# EAGLE design OPEN DROP DIGISCOPE BOARD 1 (EAGLE 9.3.0)
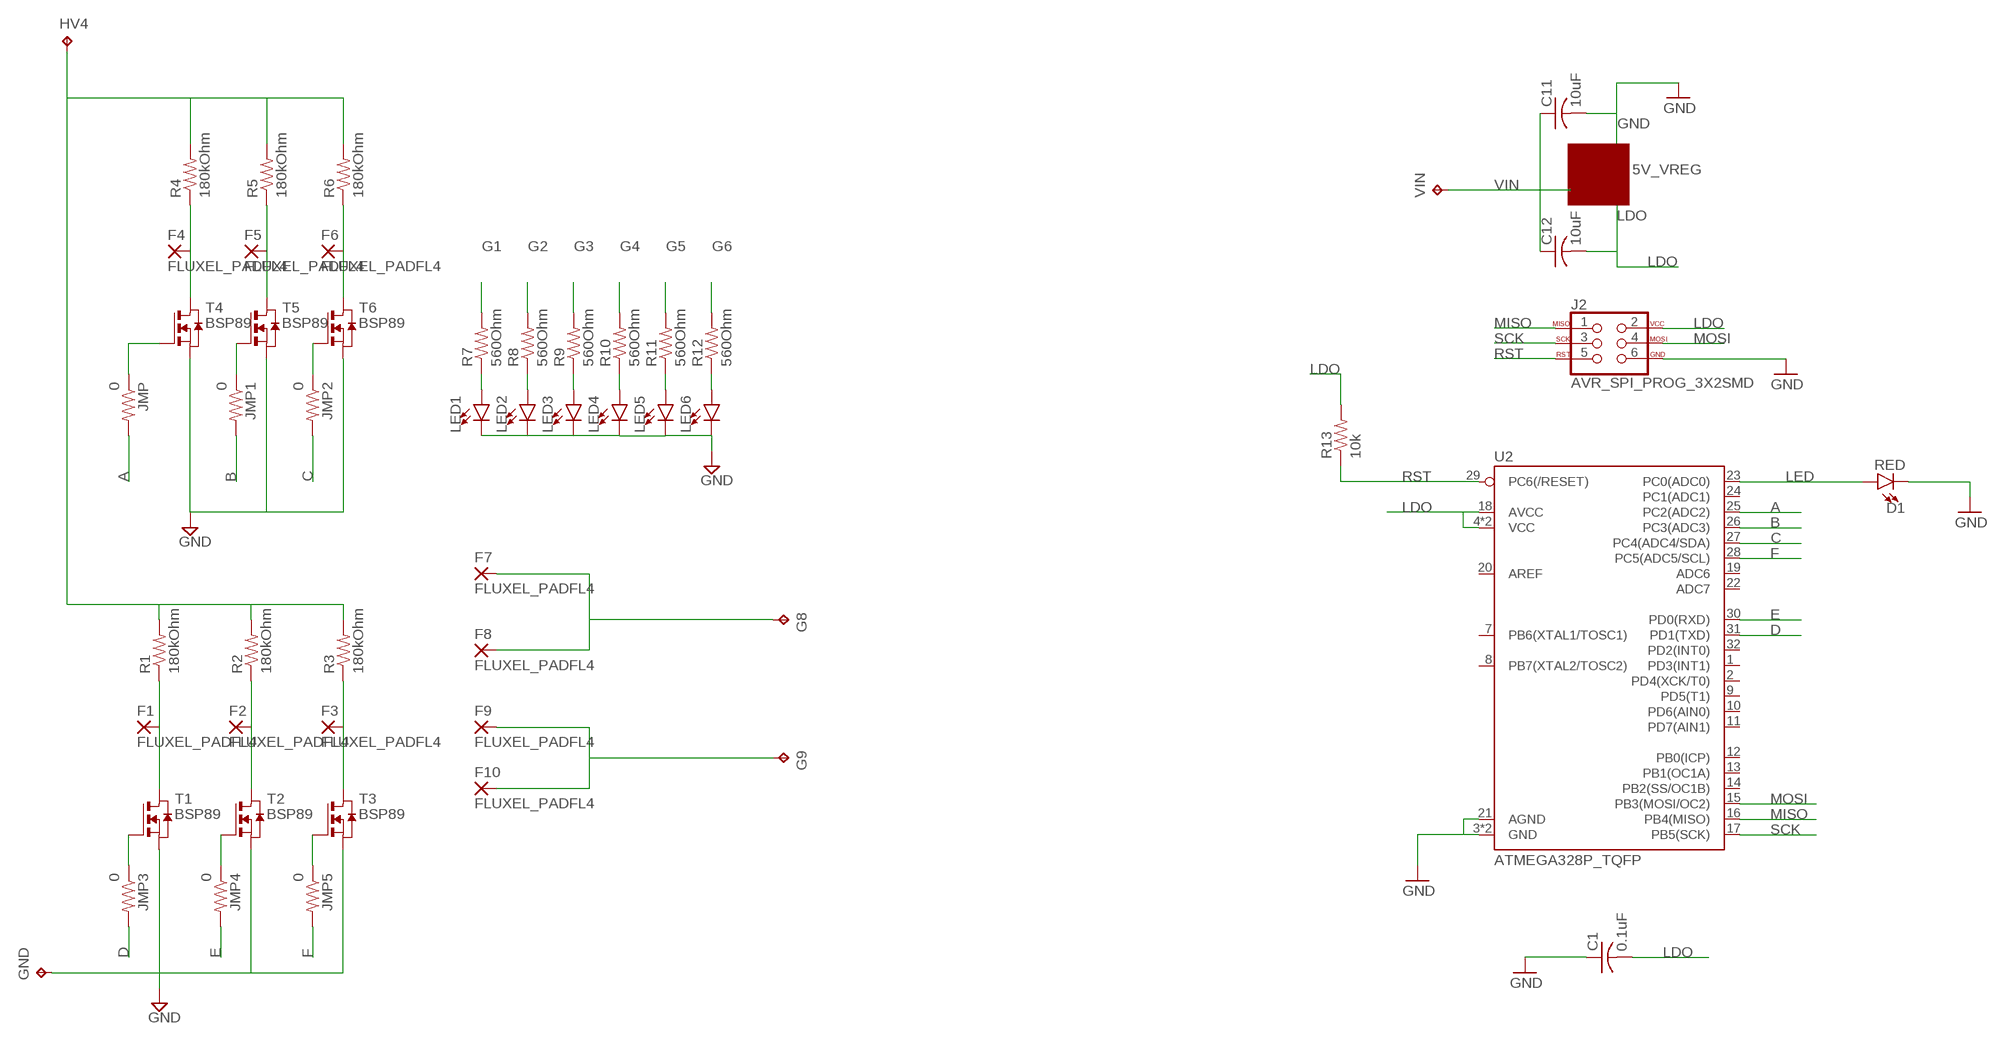
[diagram p0: schematic, sheet 1]

## Parts
5V_VREG  MOSFET_PCH-DMG2305UX-7  [SOT23-3]
C1  0.1uF  C-USC1206  [C1206]
C11  10uF  C-USC1206  [C1206]
C12  10uF  C-USC1206  [C1206]
D1  RED  LED-RED1206  [LED-1206]
F1  FLUXEL_PADFL4  [FLUXEL_PAD4]
F2  FLUXEL_PADFL4  [FLUXEL_PAD4]
F3  FLUXEL_PADFL4  [FLUXEL_PAD4]
F4  FLUXEL_PADFL4  [FLUXEL_PAD4]
F5  FLUXEL_PADFL4  [FLUXEL_PAD4]
F6  FLUXEL_PADFL4  [FLUXEL_PAD4]
F7  FLUXEL_PADFL4  [FLUXEL_PAD4]
F8  FLUXEL_PADFL4  [FLUXEL_PAD4]
F9  FLUXEL_PADFL4  [FLUXEL_PAD4]
F10  FLUXEL_PADFL4  [FLUXEL_PAD4]
G8  TPB2,54  [B2,54]
G9  TPB2,54  [B2,54]
GND  TPB2,54  [B2,54]
HV4  TPB2,54  [B2,54]
J2  AVR_SPI_PROG_3X2SMD  [2X3_SMT_POSTS]
JMP  0  R-US_M1206  [M1206]
JMP1  0  R-US_M1206  [M1206]
JMP2  0  R-US_M1206  [M1206]
JMP3  0  R-US_M1206  [M1206]
JMP4  0  R-US_M1206  [M1206]
JMP5  0  R-US_M1206  [M1206]
LED1  LED1206  [LED-1206]
LED2  LED1206  [LED-1206]
LED3  LED1206  [LED-1206]
LED4  LED1206  [LED-1206]
LED5  LED1206  [LED-1206]
LED6  LED1206  [LED-1206]
R1  180kOhm  R-US_M1206  [M1206]
R2  180kOhm  R-US_M1206  [M1206]
R3  180kOhm  R-US_M1206  [M1206]
R4  180kOhm  R-US_M1206  [M1206]
R5  180kOhm  R-US_M1206  [M1206]
R6  180kOhm  R-US_M1206  [M1206]
R7  560Ohm  R-US_M1206  [M1206]
R8  560Ohm  R-US_M1206  [M1206]
R9  560Ohm  R-US_M1206  [M1206]
R10  560Ohm  R-US_M1206  [M1206]
R11  560Ohm  R-US_M1206  [M1206]
R12  560Ohm  R-US_M1206  [M1206]
R13  10k  R-US_R1206  [R1206]
T1  BSP89  NMOSSOT223  [SOT223]
T2  BSP89  NMOSSOT223  [SOT223]
T3  BSP89  NMOSSOT223  [SOT223]
T4  BSP89  NMOSSOT223  [SOT223]
T5  BSP89  NMOSSOT223  [SOT223]
T6  BSP89  NMOSSOT223  [SOT223]
U2  ATMEGA328P_TQFP  [TQFP32-08]
VIN  TPB2,54  [B2,54]

## Nets
A: JMP.2 U2.25(PC2(ADC2))
B: JMP1.2 U2.26(PC3(ADC3))
C: JMP2.2 U2.27(PC4(ADC4/SDA))
D: JMP3.2 U2.31(PD1(TXD))
E: JMP4.2 U2.30(PD0(RXD))
F: JMP5.2 U2.28(PC5(ADC5/SCL))
G1: JMP3.1 R7.2 T1.1(G)
G2: JMP4.1 R8.2 T2.1(G)
G3: JMP5.1 R9.2 T3.1(G)
G4: JMP.1 R10.2 T4.1(G)
G5: JMP1.1 R11.2 T5.1(G)
G6: JMP2.1 R12.2 T6.1(G)
GND: 5V_VREG.3(D) C1.1 C11.2 D1.C GND.TP J2.6 LED1.C LED2.C LED3.C LED4.C LED5.C LED6.C T1.3(S) T2.3(S) T3.3(S) T4.3(S) T5.3(S) T6.3(S) U2.3(GND) U2.5(GND) U2.21(AGND)
LDO: 5V_VREG.2(S) C1.2 C12.2 J2.2 R13.2 U2.4(VCC) U2.6(VCC) U2.18(AVCC)
LED: D1.A U2.23(PC0(ADC0))
MISO: J2.1 U2.16(PB4(MISO))
MOSI: J2.4 U2.15(PB3(MOSI/OC2))
N$1: F1.1(P) R1.1 T1.2(D) T1.4(D)
N$2: F2.1(P) R2.1 T2.2(D) T2.4(D)
N$3: F3.1(P) R3.1 T3.2(D) T3.4(D)
N$4: HV4.TP R1.2 R2.2 R3.2 R4.2 R5.2 R6.2
N$5: F6.1(P) R6.1 T6.2(D) T6.4(D)
N$6: F5.1(P) R5.1 T5.2(D) T5.4(D)
N$7: F4.1(P) R4.1 T4.2(D) T4.4(D)
N$14: F7.1(P) F8.1(P) G8.TP
N$15: F9.1(P) F10.1(P) G9.TP
N$16: LED1.A R7.1
N$17: LED2.A R8.1
N$18: LED3.A R9.1
N$19: LED4.A R10.1
N$20: LED5.A R11.1
N$21: LED6.A R12.1
RST: J2.5 R13.1 U2.29(PC6(/RESET))
SCK: J2.3 U2.17(PB5(SCK))
VIN: 5V_VREG.1(G) C11.1 C12.1 VIN.TP
Unconnected: U2.1(PD3(INT1)) U2.2(PD4(XCK/T0)) U2.7(PB6(XTAL1/TOSC1)) U2.8(PB7(XTAL2/TOSC2)) U2.9(PD5(T1)) U2.10(PD6(AIN0)) U2.11(PD7(AIN1)) U2.12(PB0(ICP)) U2.13(PB1(OC1A)) U2.14(PB2(SS/OC1B)) U2.19(ADC6) U2.20(AREF) U2.22(ADC7) U2.24(PC1(ADC1)) U2.32(PD2(INT0))

## Library data of the parts
5V_VREG = SparkFun-DiscreteSemi:MOSFET_PCH: P-channel MOSFETs Voltage controlled devices that allow control of high current outputs. SparkFun Products: SparkFun ESP32 Thing <https://www.sparkfun.com/products/13907> SparkFun ESP8266 Thing <https://www.sparkfun.com/products/13231> SparkFun Pi Servo HAT V2 <https://www.sparkfun.com/products/15316> DMG2305UX-7 (20V/4.2A/SOT23-3); PROD_ID: TRAN-14388; VALUE: 20V/4.2A/52mΩ/1.4W
C1 C11 C12 = adafruit:C-US: CAPACITOR, American symbol
D1 = SparkFun-LED:LED-RED: Red SMD LED Used in manufacturing of most products at SparkFun Packages: 0603 - SMD 0603 package [Product Link] <http://docs.avagotech.com/docs/AV02-0551EN> 0603 SMART - SMD 0603 SMART package ( more efficient and expensive)[Product Link] <http://www.osram-os.com/Graphics/XPic2/00077099_0.pdf> 1206 - SMD1206 package [Product Link] <https://www.sparkfun.com/datasheets/DevTools/LilyPad/Q150OVS4.pdff> SparkFun Products: Pro Mini 328 -5V <https://www.sparkfun.com/products/821> RedBoard <https://www.sparkfun.com/products/12757> IOIO-OTG <https://www.sparkfun.com/products/13613>; PROD_ID: DIO-09912
F1-F10 = Gaudi:FLUXEL_PAD
G8 G9 GND HV4 VIN = testpad:TP: Test pad
J2 = SparkFun-Connectors:AVR_SPI_PROG_3X2: AVR ISP 6 Pin This is the reduced ISP connector for AVR programming. Common on Arduino. This footprint will take up less PCB space and can be used with a 10-pin to 6-pin adapter such as SKU: BOB-08508 **Special note about "TEST_POINT" package. The stop mask is on the top side, so if you want your programming test points to be on the bottom of your board, make sure to place this package on the bottom side of the board. This also ensure that the orientation to program from the bottom side will be correct. SparkFun Products: SparkFun ISP Pogo Adapter <https://www.sparkfun.com/products/11591> - NS Tiny AVR Programmer <https://www.sparkfun.com/products/11801> -PTH
JMP JMP1-JMP5 R1-R13 = adafruit:R-US_: RESISTOR, American symbol
LED1-LED6 = SparkFun-LED:LED: LED (Generic) Standard schematic elements and footprints for 5mm, 3mm, 1206, and 0603 sized LEDs. Generic LEDs with no color specified.
T1-T6 = zetex:NMOSSOT223: MOS FET; OC_FARNELL: unknown; OC_NEWARK: unknown
U2 = SparkFun-IC-Microcontroller:ATMEGA328P_TQFP: Popular 328P in QFP Storefront component: ATmega328 - TQFP <https://www.sparkfun.com/products/13448> (COM-13448) Datasheet <http://www.sparkfun.com/datasheets/Components/SMD/ATMega328.pdf> SparkFun Products SparkFun RedBoard - Programmed with Arduino <https://www.sparkfun.com/products/12757> (DEV-12757) Arduino Pro Mini 328 - 5V/16MHz <https://www.sparkfun.com/products/11113> (DEV-11113) Arduino Pro Mini 328 - 3.3V/8MHz <https://www.sparkfun.com/products/11114> (DEV-11114) SparkFun OpenLog <https://www.sparkfun.com/products/13712> (DEV-13712) SparkFun MicroView - OLED Arduino Module <https://www.sparkfun.com/products/12923> (DEV-12923) SparkFun Digital Sandbox <https://www.sparkfun.com/products/12651> (DEV-12651) SparkFun PicoBoard <https://www.sparkfun.com/products/11888> (WIG-11888) Arduino Fio <https://www.sparkfun.com/products/10116> (DEV-10116) LilyPad Arduino 328 Main Board <https://www.sparkfun.com/products/13342> (DEV-13342) SparkFun RedStick <https://www.sparkfun.com/products/13741> (DEV-13741) LilyPad MP3 <https://www.sparkfun.com/products/11013> (DEV-11013) LilyPad Arduino SimpleSnap <https://www.sparkfun.com/products/10941> (DEV-10941) SparkFun Stepoko <https://www.sparkfun.com/products/13899> (ROB-13899) SparkFun Geiger Counter <https://www.sparkfun.com/products/11345> (SEN-11345) SparkFun EL Sequencer <https://www.sparkfun.com/products/12781> (COM-12781) Arduino Pro 328 - 5V/16MHz <https://www.sparkfun.com/products/10915> (DEV-10915) CryptoCape <https://www.sparkfun.com/products/12773> (DEV-12773) SparkFun IR Thermometer Evaluation Board - MLX90614 <https://www.sparkfun.com/products/10740> (SEN-10740) SparkFun RedBot Mainboard <https://www.sparkfun.com/products/12097> (ROB-12097) Arduino Pro 328 - 3.3V/8MHz <https://www.sparkfun.com/products/10914> (DEV-10914) SparkFun Block for Intel® Edison - Arduino <https://www.sparkfun.com/products/13036> (DEV-13036) SparkFun Simon Says - Surface Mount Soldering Kit <https://www.sparkfun.com/products/10935> (KIT-10935) SparkFun 7-Segment Serial Display - Red <https://www.sparkfun.com/products/11441> (COM-11441) SparkFun 7-Segment Serial Display - White <https://www.sparkfun.com/products/11629> (COM-11629) SparkFun 7-Segment Serial Display - Yellow <https://www.sparkfun.com/products/11443> (COM-11443) SparkFun 7-Segment Serial Display - Kelly Green <https://www.sparkfun.com/products/11440> (COM-11440) SparkFun 7-Segment Serial Display - Blue <https://www.sparkfun.com/products/11442> (COM-11442) SparkFun OpenSegment Serial Display - 20mm (Blue) <https://www.sparkfun.com/products/11647> (COM-11647) SparkFun OpenSegment Serial Display - 20mm (Green) <https://www.sparkfun.com/products/11646> (COM-11646) SparkFun OpenSegment Serial Display - 20mm (White) <https://www.sparkfun.com/products/11648> (COM-11648) SparkFun OpenSegment Serial Display - 20mm (Red) <https://www.sparkfun.com/products/11644> (COM-11644) SparkFun OpenSegment Serial Display - 20mm (Yellow) <https://www.sparkfun.com/products/11645> (COM-11645) SparkFun OpenSegment Shield <https://www.sparkfun.com/products/13190> (DEV-13190); PROD_ID: IC-09069

## Board
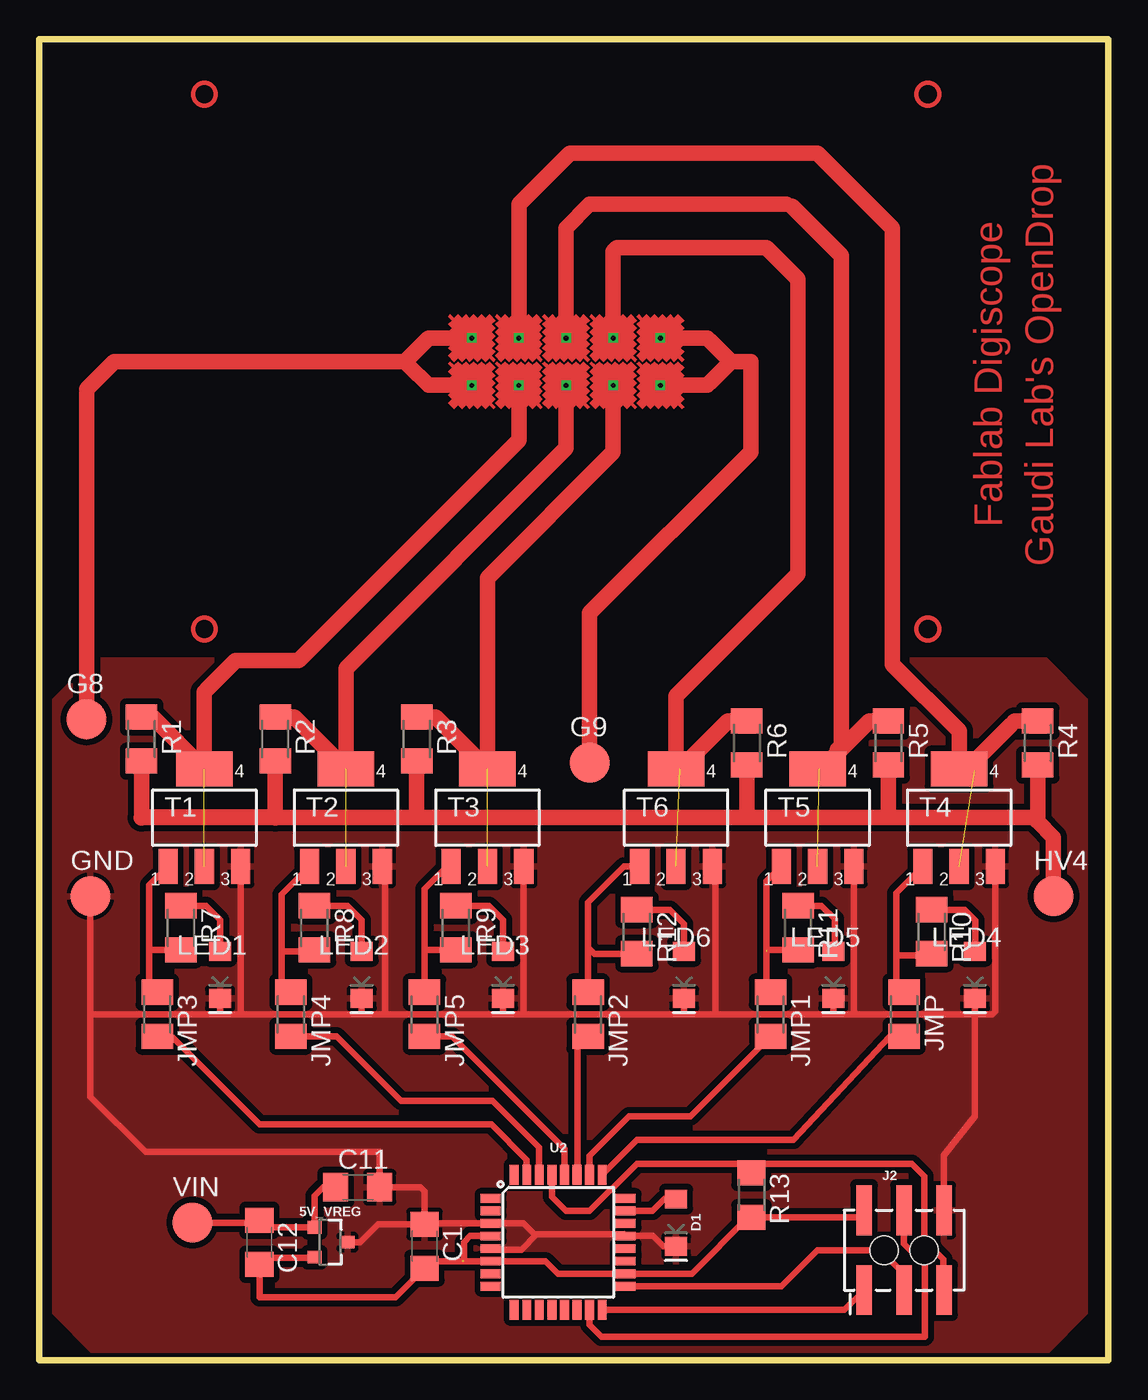
[diagram p1: board, top side]
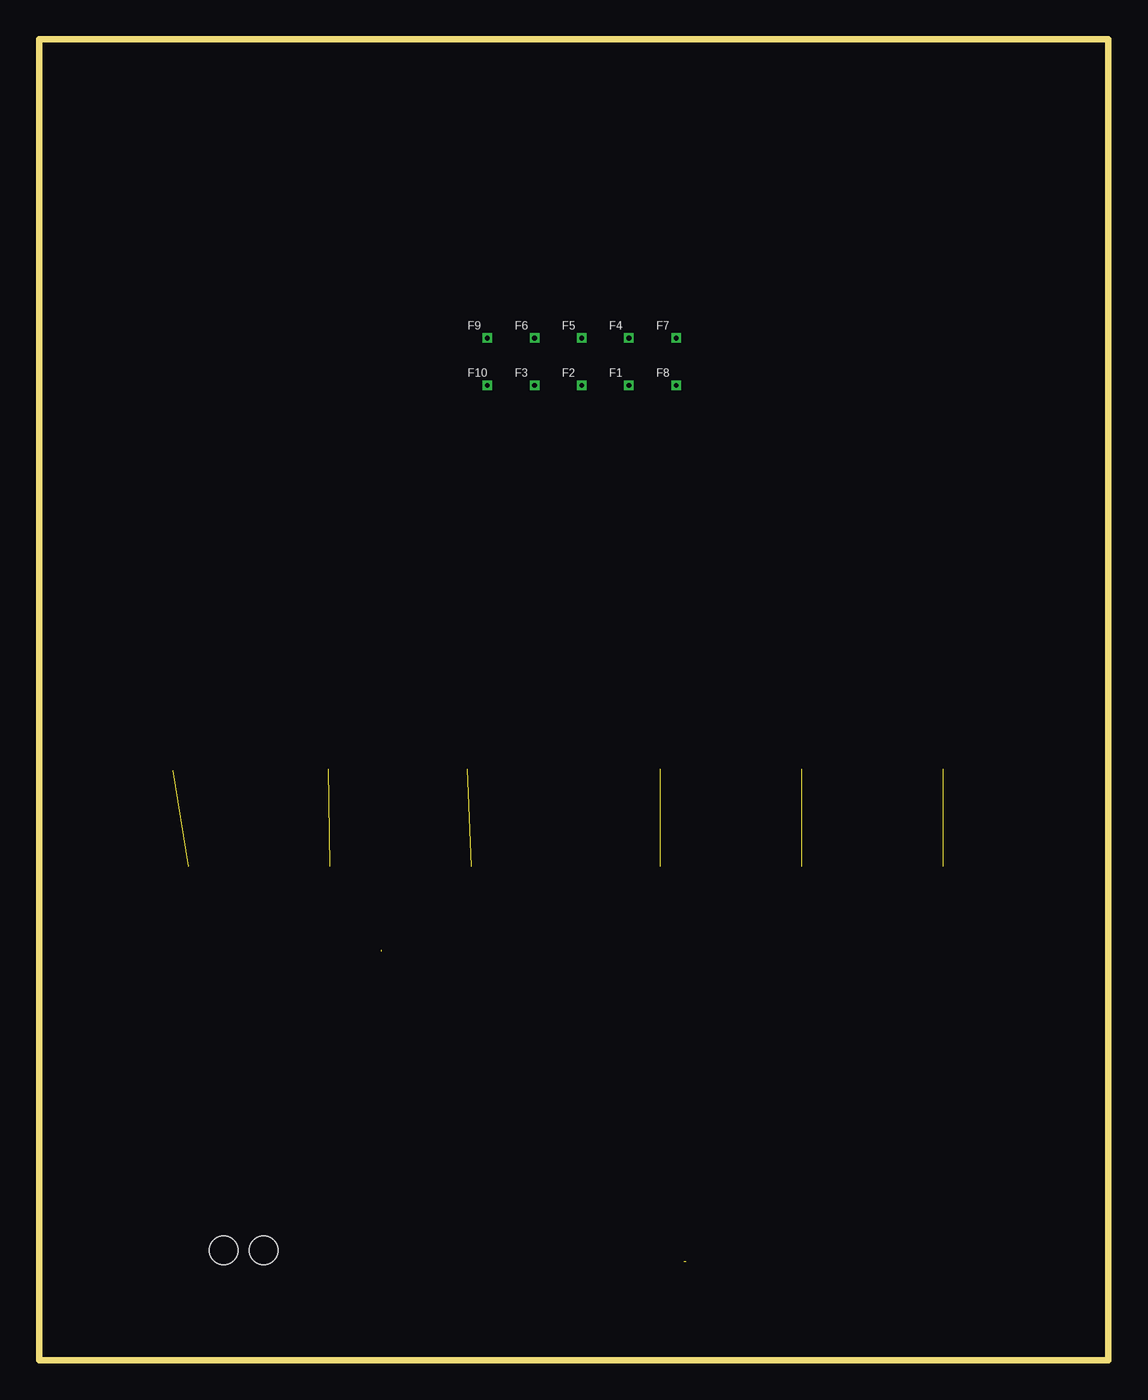
[diagram p2: board, bottom side, seen from below]

Size 68 x 84 mm. Coordinates in mm from the lower left corner, seen from the top.
Outline: 0,84 68,84 68,0 0,0 0,84
Copper layers (1*2*15*16): Top 0.035mm / dielectric 0.2mm / Route2 0.0175mm / dielectric 1.1mm / Route15 0.0175mm / dielectric 0.2mm / Bottom 0.035mm
Design rules "SeeedStudio_DRU_no_angle_20130527 *": minimum track width 1mm, minimum drill 16mil, track to track 15mil, track to pad 15mil, pad to pad 15mil, via to via 15mil, smd to smd 0mil, copper to edge 10mil, drill to drill 10mil, minimum pad ring 6mil, minimum via ring 6mil, stop-mask expansion 2mil, vias tented up to drill 25mil, thermal gap 10mil

### Footprints (pad centres in the part's own frame; a part is rotated, then mirrored left to right if it is on the bottom)
SOT23-3 = smd 0.8 x 0.9: 1 -0.95,-1; 2 0.95,-1; 3 0,1.1
C1206 = smd 1.6 x 1.8: 1 -1.4,0; 2 1.4,0
LED-1206 = smd 1.2 x 1.4: A -1.5,0; C 1.5,0
FLUXEL_PAD4 = drill 0.3 square: 1 0,0
B2,54 = smd 2.54 x 2.54: TP 0,0
2X3_SMT_POSTS = smd 1 x 3.17: 1 -2.54,-2.54; 2 -2.54,2.54; 3 0,-2.54; 4 0,2.54; 5 2.54,-2.54; 6 2.54,2.54 | hole 1.8: -1.27,0; 1.27,0
M1206 = smd 1.6 x 2: 1 -1.4,0; 2 1.4,0
R1206 = smd 1.6 x 1.803: 1 -1.422,0; 2 1.422,0
SOT223 = smd 1.219 x 2.235: 1 -2.311,-3.099; 2 0,-3.099; 3 2.311,-3.099 | smd 3.6 x 2.2: 4 0,3.099
TQFP32-08 = smd 1.27 x 0.559: 1 -4.293,2.8; 2 -4.293,2; 3 -4.293,1.2; 4 -4.293,0.4; 5 -4.293,-0.4; 6 -4.293,-1.2; 7 -4.293,-2; 8 -4.293,-2.8; 17 4.293,-2.8; 18 4.293,-2; 19 4.293,-1.2; 20 4.293,-0.4; 21 4.293,0.4; 22 4.293,1.2; 23 4.293,2; 24 4.293,2.8 | smd 0.559 x 1.27: 9 -2.8,-4.293; 10 -2,-4.293; 11 -1.2,-4.293; 12 -0.4,-4.293; 13 0.4,-4.293; 14 1.2,-4.293; 15 2,-4.293; 16 2.8,-4.293; 25 2.8,4.293; 26 2,4.293; 27 1.2,4.293; 28 0.4,4.293; 29 -0.4,4.293; 30 -1.2,4.293; 31 -2,4.293; 32 -2.8,4.293

### Placement (x,y rotation side)
5V_VREG  18.5,7.5 270 top
C1  24.5,7.25 270 top
C11  20.25,11 0 top
C12  14,7.5 270 top
D1  40.5,8.75 270 top
F1  30.5,62 0 bottom
F2  33.5,62 0 bottom
F3  36.5,62 0 bottom
F4  30.5,65 0 bottom
F5  33.5,65 0 bottom
F6  36.5,65 0 bottom
F7  27.5,65 0 bottom
F8  27.5,62 0 bottom
F9  39.5,65 0 bottom
F10  39.5,62 0 bottom
G8  3,40.75 0 top
G9  35,38 0 top
GND  3.25,29.5 0 top
HV4  64.5,29.5 0 top
J2  55,7 0 top
JMP  55,22 270 top
JMP1  46.5,22 270 top
JMP2  34.9,22 270 top
JMP3  7.5,22 270 top
JMP4  16,22 270 top
JMP5  24.5,22 270 top
LED1  11.5,24.5 270 top
LED2  20.5,24.5 270 top
LED3  29.5,24.5 270 top
LED4  59.5,24.5 270 top
LED5  50.5,24.5 270 top
LED6  41,24.5 270 top
R1  6.5,39.5 270 top
R2  15,39.5 270 top
R3  24,39.5 270 top
R4  63.5,39.25 270 top
R5  54,39.25 270 top
R6  45,39.25 270 top
R7  9,27.5 270 top
R8  17.5,27.5 270 top
R9  26.5,27.5 270 top
R10  56.75,27.25 270 top
R11  48.25,27.5 270 top
R12  38,27.25 270 top
R13  45.29,10.5 270 top
T1  10.5,34.5 0 top
T2  19.5,34.5 0 top
T3  28.5,34.5 0 top
T4  58.5,34.5 0 top
T5  49.5,34.5 0 top
T6  40.5,34.5 0 top
U2  33,7.5 0 top
VIN  9.75,8.75 0 top

### Tracks (layer width: path | path; a pad name or v marks a point on that pad's centre or on a via)
A
  Top 0.406: U2.25 38.01,14 47.97,14 54.1,20.6 JMP.2
B
  Top 0.406: JMP1.2 41.4,15.5 37.5,15.5 35,13 U2.26
C
  Top 0.406: U2.27 34.23,11.83 34.23,19.93 JMP2.2
D
  Top 0.406: U2.31 31,12.75 28.75,15 14,15 8.5,20.5 7,20.5 7.1,20.6 JMP3.2
E
  Top 0.406: U2.30 31.8,13.53 28.83,16.5 23,16.5 18.9,20.6 JMP4.2
F
  Top 0.406: U2.28 33.4,13.45 26.25,20.6 JMP5.2
G1
  Top 0.406: T1.1 7,30.21 7,26 | 7,26 7,23.9 JMP3.1 | 7,26 7.1,26.1 R7.2
G2
  Top 0.406: 15.42,26 15.42,29.63 T2.1 | 15.42,26 15.42,23.98 JMP4.1 | R8.2 17.4,26 15.42,26
G3
  Top 0.406: T3.1 25.94,31.4 24.5,29.96 24.5,26 | 24.5,26 JMP5.1 | R9.2 24.6,26.1 24.5,26
G4
  Top 0.406: T4.1 54.5,29.71 54.5,25.75 | 54.5,25.75 54.5,23.9 JMP.1 | R10.2 56.65,25.75 54.5,25.75
G5  (1 unrouted)
  Top 0.406: T5.1 46.25,30.46 46.25,26 | JMP1.1 46.25,23.65 46.25,26.1 R11.2
G6
  Top 0.406: JMP2.1 34.9,26.25 | 34.9,26.25 34.9,27.65 34.9,29.11 37.19,31.4 T6.1 | R12.2 35.3,25.85 34.9,26.25
GND
  Top 0.406: T1.3 12.81,22.19 13,22 | 13,22 20.5,22 | 20.5,22 22,22 | 22,22 22,31.21 T2.3 | T3.3 30.81,22 41,22 | 31,22 29.5,22 | 29.5,22 22,22 | T4.3 60.81,22.19 60.62,22 59.5,22 | 43,22 43,30.21 T6.3 | T5.3 51.81,22.19 52,22 | 3.5,22 11.5,22 | 11.5,22 13,22 | LED1.C 11.5,22 | LED2.C 20.5,22 | LED3.C 29.5,22 | 31.63,8 37.19,8 U2.21 39.04,7.9 39.69,7.25 D1.C | 31.63,8 31.5,8 30.8,8.7 U2.3 24.55,8.7 C1.1 | U2.5 28.78,7.03 30.66,7.03 31.63,8 | C1.1 21.55,8.65 20.4,7.5 5V_VREG.3 | C11.2 21.79,11 | GND.TP 3.25,16.75 6.75,13.25 21.65,13.25 C11.2 | LED4.C 59.5,22 | 59.5,22 59.5,15.5 57.54,13.04 J2.6 | 41,22 43,22 | 43,22 50.5,22 | 50.5,22 59.5,22 | C11.2 24.25,11 24.5,10.75 C1.1 | LED6.C 41,22 | LED5.C 50.5,22
  pour Top: 3.5,44.5 64,44.5 66.5,42 66.5,3 64,0.5 3.5,0.5 1,3 1,42
LDO  (1 unrouted)
  Top 0.406: 26.89,6.29 U2.6 32.2,6.3 33,5.5 U2.18 41.5,5.5 45.08,9.08 R13.2 | U2.4 27.4,7.9 27,7.5 27,6.29 24.95,6.29 C1.2 22.65,4 14,4 C12.2 13.9,6.1 13.5,6.5 17.45,6.5 5V_VREG.2 | 45.03,9.03 R13.2 | J2.2 52,9.08 R13.2
LED
  Top 0.406: U2.23 39,9.5 39.75,10.25 D1.A
MISO
  Top 0.406: J2.1 51.21,3.21 U2.16
MOSI
  Top 0.406: U2.15 35,2.25 35.75,1.5 56.34,1.5 56.34,6.06 55,7.4 J2.4
N$1  (1 unrouted)
  Top 0.406: 10.5,42.5 10.62,42.62
  Top 1: R1.1 7.2,40.9 T1.4 10.5,42.5 | 10.62,42.62 12.5,44.5 16.5,44.5 30.5,58.5 F1.1
N$2  (1 unrouted)
  Top 0.406: 15.25,40.9 R2.1
  Top 1: 15.25,40.9 16.2,40.9 T2.4 19.5,44 33.5,58 F2.1
N$3  (1 unrouted)
  Top 0.406: 28.5,49.5 28.5,37.75 | 28.5,37.75 T3.4 | R3.1 25.35,40.9 28.5,37.75
  Top 1: R3.1 25.2,40.9 T3.4 28.5,49.5 28.5,49.75 36.5,57.75 F3.1
N$4
  Top 0.406: R5.2 54,37.75 54,34.5 | 45,34.5 R6.2 | 63.5,34.5 R4.2 | 24,35 R3.2
  Top 1: 24.25,34.5 15,34.5 R2.2 | 24.25,34.5 45.25,34.5 | 45.25,34.5 54.25,34.5 | 54.25,34.5 63.25,34.5 63.5,34.25 | 63.5,34.25 64.5,33.25 HV4.TP | 6.5,34.5 R1.2 | 24.25,34.5 24,34.75 R3.2 | 45.25,34.5 45,34.75 R6.2 | 54.25,34.5 54,34.75 54,37.75 | 63.5,34.25 R4.2
  Top 1.016: 15,34.5 6.5,34.5
N$5  (1 unrouted)
  Top 0.406: F6.1 36.5,65.75
  Top 1: R6.1 43.8,40.65 40.75,37.6 T6.4 40.5,42.25 48.25,50 48.25,68.75 46.25,70.75 36.75,70.75 36.5,70.5 36.5,65.75
N$6  (1 unrouted)
  Top 0.406: F5.1 33.5,66.25 | 47.5,73.5 47.75,73.5 47.88,73.38 | 50,38 49.6,37.6 T5.4 50.25,37.6 50.75,38.1 | 53.9,40.75 R5.1 52.55,40.65 51,39.1 50.75,38.85
  Top 1: T5.4 49.75,37.6 52.8,40.65 R5.1 | 33.5,66.25 33.5,72 35,73.5 47.5,73.5 | 47.88,73.38 51,70.25 51,39.1 | 50.75,38.85 50.75,38.1
N$7  (1 unrouted)
  Top 0.406: F4.1 30.5,66.25 | 59.5,37.5 59.4,37.6 59,37.6 | 63.4,40.75 R4.1 | 61.95,40.55 61.83,40.42
  Top 1: 61.83,40.42 59,37.6 T4.4 58.5,40 54.25,44.25 54.25,72 49.5,76.75 33.75,76.75 30.5,73.5 30.5,66.25 | R4.1 62.05,40.65 61.95,40.55
N$14
  Top 0.406: 23.5,63.5 23.5,63.25 | 23.5,63.5 23.5,64 24.5,65 F7.1 | 23.5,63.5 23.25,63.5 | 3,61.75 3,61.5 | 3,41 G8.TP
  Top 1: F7.1 24.75,65 23.25,63.5 | F8.1 24.75,62 23.5,63.25 23.25,63.5 | 23.25,63.5 4.75,63.5 3,61.75 | 3,61.5 3,41
N$15
  Top 0.406: F9.1 40.5,65 | 42.5,65 42.62,64.88 43.5,64 43.5,63.5 | 43.5,63.5 43.5,63 42.62,62.12 42.5,62 | F10.1 40,62 | 45.25,63.5 43.5,63.5
  Top 1: 40.5,65 42.5,65 | 42.62,64.88 44,63.5 | 44,63.5 45.25,63.5 45.25,57.75 35,47.5 G9.TP | 40,62 42.5,62 | 44,63.5 42.62,62.12
N$16
  Top 0.406: 9.59,28.3 R7.1 10.6,28.9 11.5,28 LED1.A
N$17
  Top 0.406: LED2.A 20.5,28 19.6,28.9 R8.1
N$18
  Top 0.406: 26.86,28.54 R9.1 28.6,28.9 29.5,28 LED3.A
N$19
  Top 0.406: LED4.A 59.85,26.05 59.53,25.73 | 59.53,25.73 59.4,25.6 | R10.1 58.85,28.65 59.53,27.98 59.53,25.73
N$20
  Top 0.406: R11.1 49.75,28.9 50.6,28.05 50.6,26.1 LED5.A
N$21
  Top 0.406: LED6.A 41,27.75 40.1,28.65 R12.1
RST
  Top 0.406: J2.5 57.5,4.5 57.5,6.4 56.3,7.6 56.3,11.7 55.5,12.5 45.87,12.5 R13.1 44.72,12.5 38,12.5 35,9.5 33.5,9.5 32.6,10.4 U2.29
SCK
  Top 0.406: J2.3 55,5.5 53.5,7 49.5,7 47.2,4.7 U2.17
VIN
  Top 0.406: C11.1 18.06,11 17.85,10.8 17.5,10.45 5V_VREG.1 14.45,8.45 C12.1 13.85,8.75 VIN.TP
(copper drawn outside any net)
  shapes: Top circle x4

### Text on the board
Top: Fablab Digiscope | Gaudi Lab's OpenDrop